# EAGLE design Power (EAGLE 6.1)
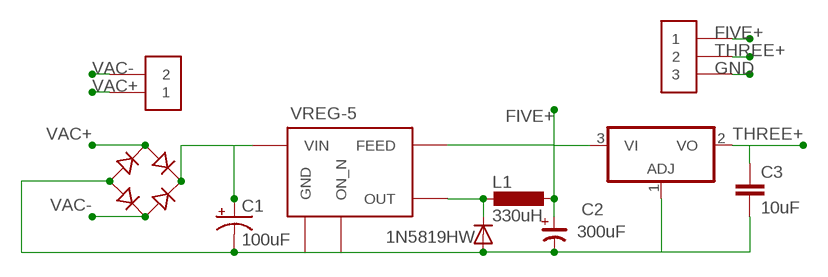
[diagram p0: schematic, sheet 1]

## Parts
B1  RECTIFIER-S80  [TO-269AA]
C1  100uF  CPOL-USG  [PANASONIC_G]
C2  300uF  CP_SV-H  [CSV-H]
C3  10uF  C5/2.5  [C5B2.5]
D8  CGRM4001-G  [SOD-123_MINI-SMA]
L1  330uH  DO3316P  [DO3316P]
LT1086-3.3  317T  [TO220H]
U$2  OSTTC020162  [OSTTC020162]
U$3  OSTTC030162  [OSTTC030162]
VREG-5  TL2575-05  [TO-263-5]

## Nets
FIVE+: C2.+ L1.2 LT1086-3.3.3(VI) U$3.1 VREG-5.4(FEED)
GND: B1.- C1.- C2.- C3.2 D8.A LT1086-3.3.1(ADJ) U$3.3 VREG-5.3(GND) VREG-5.5(ON_N) VREG-5.TAB(GND)
N$4: D8.C L1.1 VREG-5.2(OUT)
THREE+: C3.1 LT1086-3.3.2(VO) U$3.2
VAC+: B1.AC1 U$2.1
VAC-: B1.AC2 U$2.2
VUNREG: B1.+ C1.+ VREG-5.1(VIN)

## Notes on the sheet
- VREG-5
- 1N5819HW

## Library data of the parts
B1 = rectifier:RECTIFIER-: Rectifier
C1 = rcl:CPOL-US: POLARIZED CAPACITOR, American symbol
C2 = rc-master:CP_: POLARIZED CAP
C3 = capacitor-wima:C: CAPACITOR naming: grid - package width
D8 = diode:CGRM400*-G: Molded plasitc,JEDEC SOD-123/Mini SMA Source: Comchip CGRM4001-G.pdf
L1 = TylersLib:DO3316P: COILCRAFT; OC_FARNELL: unknown; OC_NEWARK: unknown
LT1086-3.3 = linear:*317: Positive VOLTAGE REGULATOR
U$2 = TylersLib:OSTTC020162
U$3 = TylersLib:OSTTC030162
VREG-5 = texas:TL2575-05

## Board
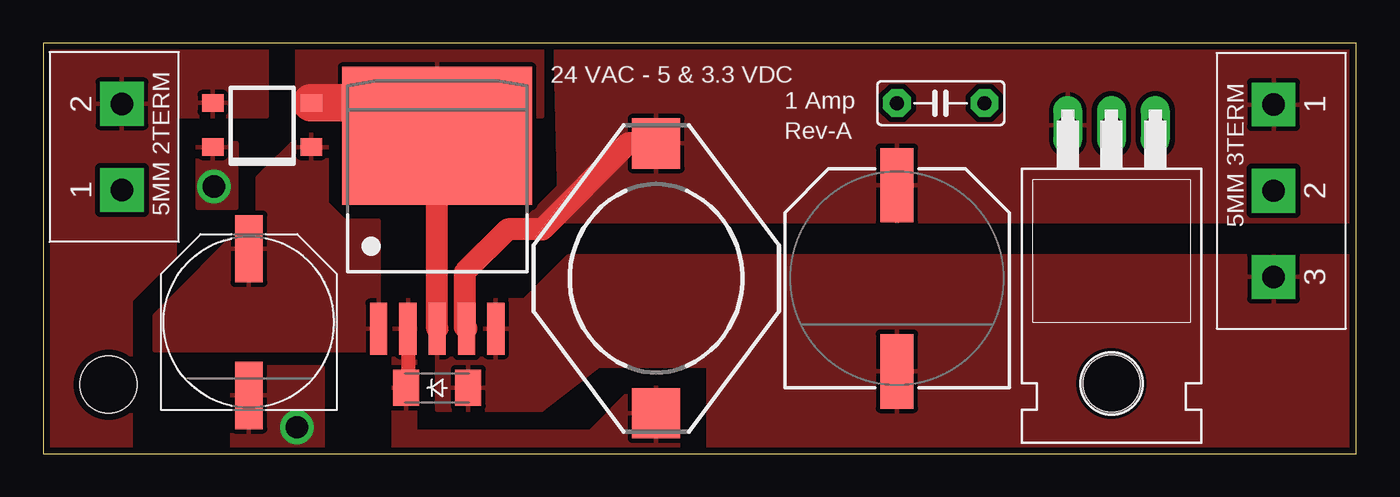
[diagram p1: board, top side]
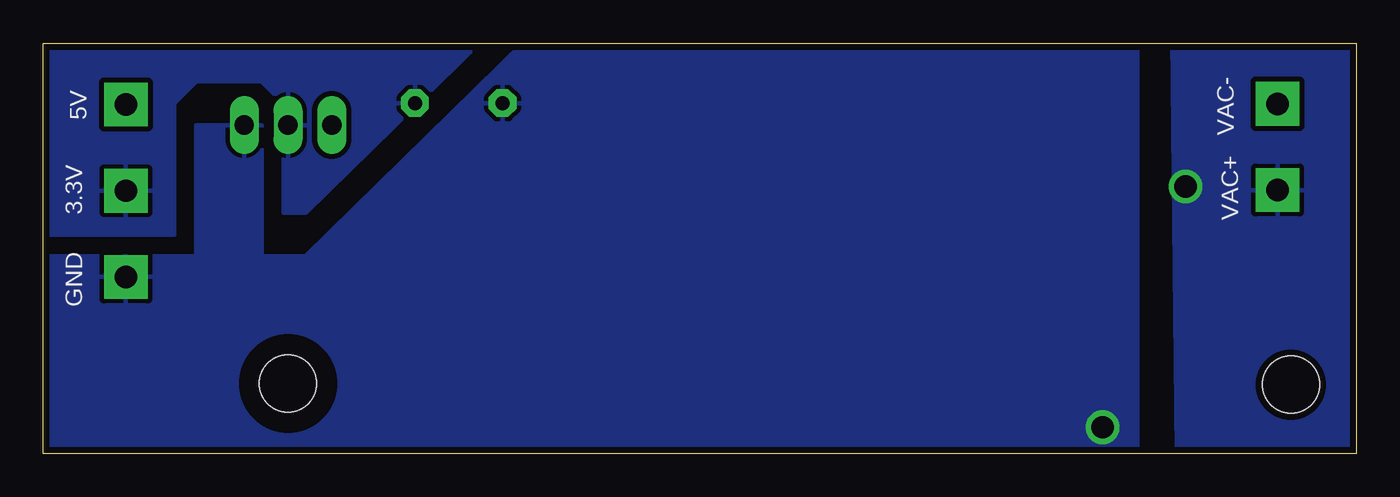
[diagram p2: board, bottom side, seen from below]

Size 76.18 x 23.8 mm. Coordinates in mm from the lower left corner, seen from the top.
Outline: 0,0 76.18,0 76.18,23.8 0,23.8 0,0
Copper layers (1*16): Top 0.0356mm / dielectric 1.5011mm / Bottom 0.0356mm
Design rules: minimum track width 6mil, minimum drill 13mil, track to track 6mil, track to pad 6mil, pad to pad 6mil, via to via 6mil, smd to smd 6mil, copper to edge 15mil, drill to drill 6mil, minimum pad ring 7mil, minimum via ring 7mil, stop-mask expansion 4mil, vias tented up to drill 0mil, thermal gap 10mil
Holes 3.3 mm at 3.8,4

### Footprints (pad centres in the part's own frame; a part is rotated, then mirrored left to right if it is on the bottom)
TO-269AA = smd 1 x 1.25: + -1.28,-2.855; - 1.28,-2.855; AC1 -1.28,2.855; AC2 1.28,2.855
PANASONIC_G = smd 3.9 x 1.6: + 4.25,0; - -4.25,0
CSV-H = smd 4.318 x 1.93: + -5.397,0; - 5.397,0
C5B2.5 = drill 0.813 pad 1.6 octagon: 1 -2.54,0; 2 2.54,0
SOD-123_MINI-SMA = smd 1.5 x 2.1: A 1.8,0; C -1.8,0
DO3316P = smd 2.92 x 2.79: 1 -6.55,0; 2 9.09,0
TO220H = drill 1.118 long: 1 -2.54,-10.16; 2 0,-10.16; 3 2.54,-10.16 | hole 3.302: 0,4.826
OSTTC020162 = drill 1.3 pad 2.54 square: 1 -2.5,0; 2 2.5,0
OSTTC030162 = drill 1.3 pad 2.54 square: 1 -5,0; 2 0,0; 3 5,0
TO-263-5 = smd 1 x 3: 1 1.68,2.16; 2 3.38,2.16; 3 5.08,2.16; 4 6.78,2.16; 5 8.48,2.16 | smd 11 x 8: TAB 5.08,13.335

### Placement (x,y rotation side)
B1  12.7,19.05 90 top
C1  11.94,7.62 90 top
C2  49.53,10.16 270 top
C3  52.07,20.32 180 top
D8  22.86,3.81 0 top
L1  35.56,8.89 90 top
LT1086-3.3  61.98,8.89 180 top
U$2  4.57,17.78 90 top
U$3  71.37,15.24 270 top
VREG-5  17.78,5.08 0 top

### Tracks (layer width: path | path; a pad name or v marks a point on that pad's centre or on a via)
FIVE+
  Top 1.27: L1.2 33.94,17.98 28.96,13 26.96,13 24.46,10.5 24.46,7.34 VREG-5.4
  pour Top (isolate 0.305): 24.46,11 26.96,13.5 27.96,13.5 29.96,15.5 30.21,13.51 29.19,13.01 26.96,12.5 24.96,10.5
  pour Top (isolate 0.305): 76.2,13.46 29.97,13.46 29.72,23.88 75.95,23.88
GND  (via drill 1.3)
  Top 1.27: 24.77,20.32 VREG-5.TAB VREG-5.3
  Top 2.184: B1.- 20.95,20.33 VREG-5.TAB
  other vias: 14.73,1.52
  pour Top (isolate 0.305): 76.2,11.43 30.48,11.43 27.94,8.89 22.86,8.89 22.86,2.54 28.96,2.54 32.26,5.08 38.61,5.08 38.61,0 76.2,0
  pour Bottom (isolate 0.305): 12.7,24.13 12.7,0 76.2,0 76.2,11.43 67.31,11.43 67.31,19.05 63.5,19.05 63.5,11.43 60.96,11.43 48.26,23.88
  pour Top (isolate 0.305): 10.96,-0.02 16.22,-0.02 16.22,5 10.96,5
  pour Top (isolate 0.305): 28.96,19.56 14.73,19.56 14.73,23.88 28.96,23.88
N$4
  Top 0.813: VREG-5.2 21.16,3.91 D8.C
  pour Top (isolate 0.305): 36.83,3.81 34.29,3.81 31.75,1.27 21.59,1.27 21.59,8.89 20.32,8.89 20.32,0 36.83,0
THREE+
  pour Bottom (isolate 0.305): 60.96,13.97 50.8,23.88 76.2,23.88 76.2,12.7 68.58,12.7 68.58,20.32 67.31,21.59 63.5,21.59 62.23,20.32 62.23,13.97
VAC+  (via drill 1.3)
  other vias: 9.91,15.49
  pour Bottom (isolate 0.305): 10.41,0 10.67,24.13 0,24.13 0,0
  pour Top (isolate 0.305): 11.23,18.01 11.21,16.25 11.21,14.25 8.97,14.25 8.97,18 10.72,18
VAC-
  pour Top (isolate 0.305): 12.95,24.13 12.95,19.56 7.62,19.56 7.62,11.43 5.08,8.89 5.08,0 0,0 0,24.13
VUNREG
  pour Top (isolate 0.305): 19.46,6 19.46,13.5 17.46,13.5 16.46,14.5 16.46,18.5 14.96,18.5 12.46,16 12.46,13.5 11.96,13.5 6.46,8 6.46,6

### Text on the board
tPlace: 24 VAC - 5 & 3.3 VDC | 1 Amp | Rev-A
bNames: VAC- | 5V | VAC+ | 3.3V | GND